# EAGLE schematic Main_Board (EAGLE 9.2.2)
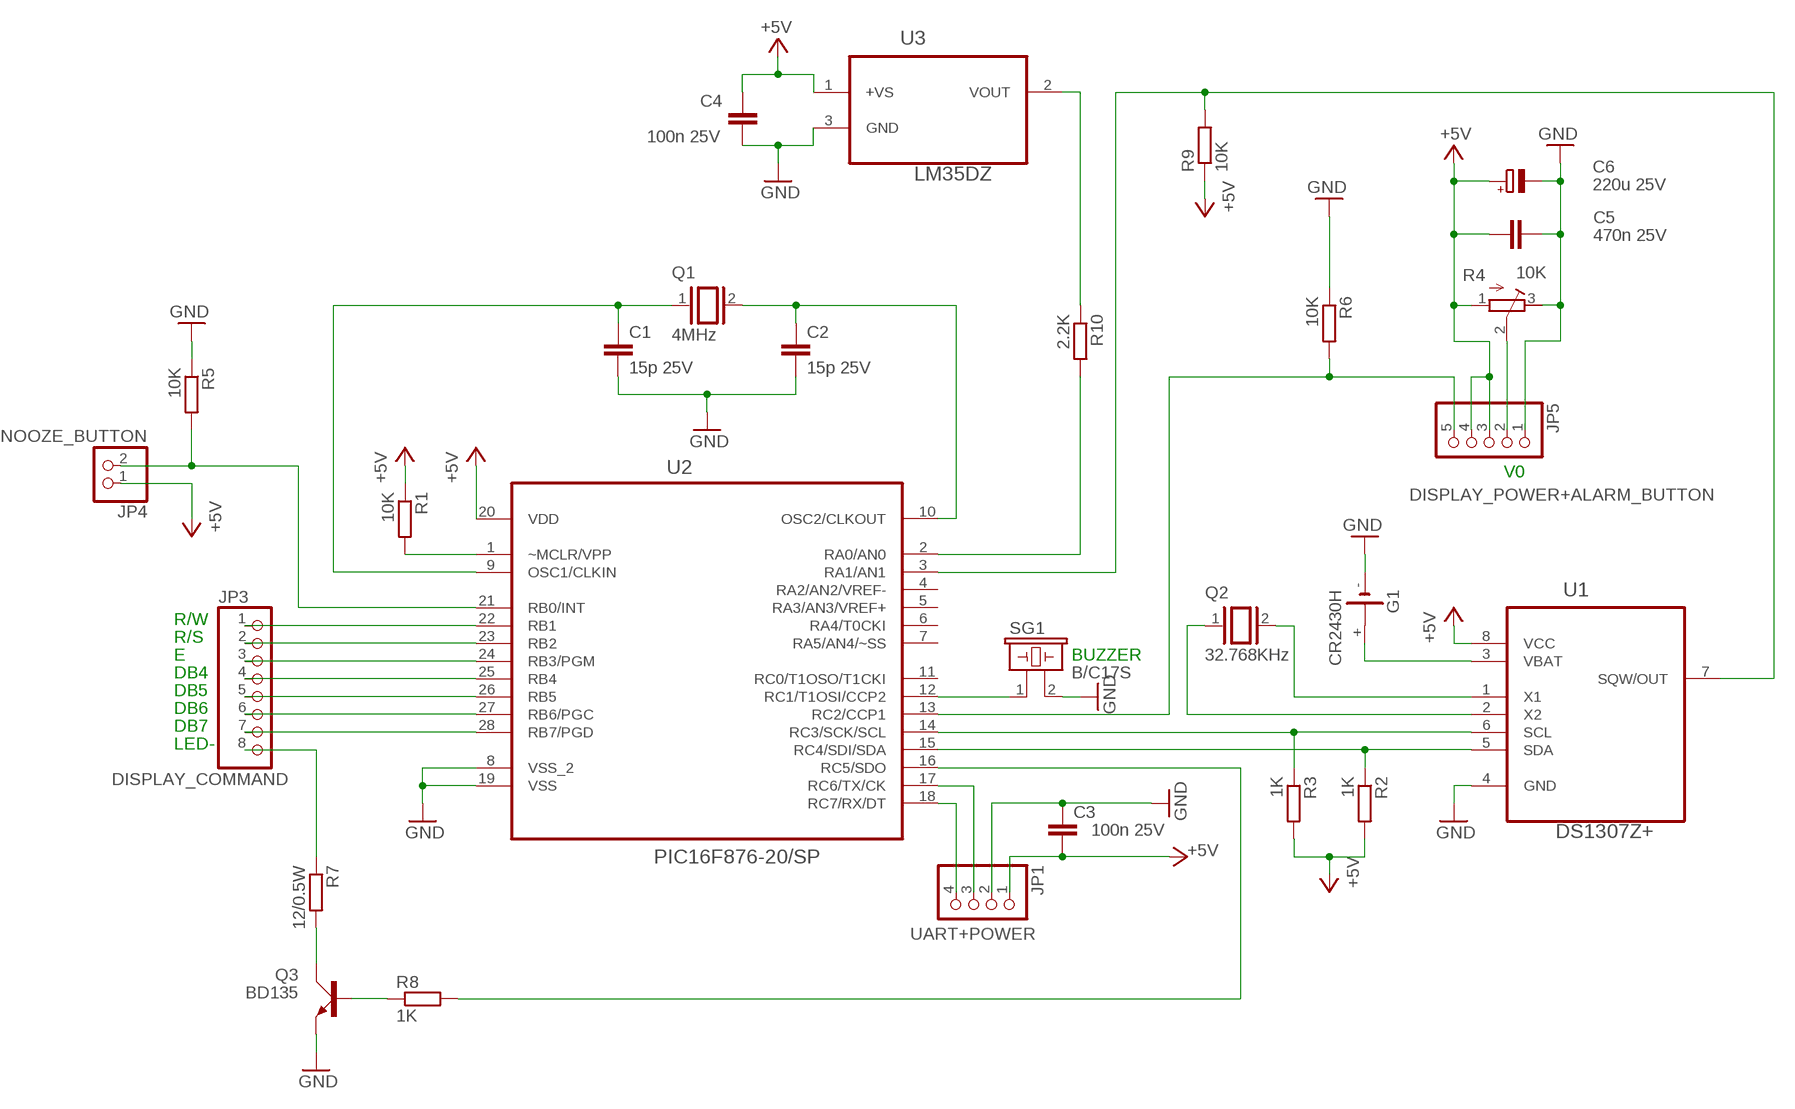
[diagram p0: schematic, sheet 1]

## Parts
C1  15p 25V  C2,5-3  [C2.5-3]
C2  15p 25V  C2,5-3  [C2.5-3]
C3  100n 25V  C5/3.5  [C5B3.5]
C4  100n 25V  C-EU025-025X050  [C025-025X050]
C5  470n 25V  C-EU025-025X050  [C025-025X050]
C6  220u 25V  CPOL-EUE2.5-6  [E2,5-6]
G1  CR2430H  [CR2430H]
JP1  UART+POWER  PINHD-1X4  [1X04]
JP3  DISPLAY_COMMAND  PINHD-1X8  [1X08]
JP4  SNOOZE_BUTTON  PINHD-1X2  [1X02]
JP5  DISPLAY_POWER+ALARM_BUTTON  PINHD-1X5  [1X05]
Q1  4MHz  XTAL/S  [QS]
Q2  32.768KHz  XTAL/S  [QS]
Q3  BD135  BD139  [TO126AV]
R1  10K  R-EU_0207/12  [0207/12]
R2  1K  R-EU_0207/12  [0207/12]
R3  1K  R-EU_0207/12  [0207/12]
R4  10K  R-TRIMM3339P  [RTRIM3339P]
R5  10K  R-EU_0207/12  [0207/12]
R6  10K  R-EU_0207/12  [0207/12]
R7  12/0.5W  R-EU_0207/12  [0207/12]
R8  1K  R-EU_0207/12  [0207/12]
R9  10K  R-EU_0207/12  [0207/12]
R10  2.2K  R-EU_0207/12  [0207/12]
SG1  B/C17S  [B/C17S]
U1  DS1307Z+  [SOIC127P600X175-8N]
U2  PIC16F876-20/SP  [DIP254P762X406-28]
U3  LM35DZ  [TO127P254X495-3P]

## Nets
+5V: C3.2 C4.1 C5.1 C6.+ JP1.1 JP4.1 JP5.3 JP5.4 R1.1 R2.2 R3.2 R4.1(A) R9.1 U1.8(VCC) U2.20(VDD) U3.1(+VS)
GND: C1.2 C2.2 C3.1 C4.2 C5.2 C6.- G1.- JP1.2 JP5.1 Q3.E R4.3(E) R5.1 R6.1 SG1.2 U1.4(GND) U2.8(VSS_2) U2.19(VSS) U3.3(GND)
N$1: R1.2 U2.1(~MCLR/VPP)
N$2: C1.1 Q1.1 U2.9(OSC1/CLKIN)
N$3: C2.1 Q1.2 U2.10(OSC2/CLKOUT)
N$4: SG1.1 U2.12(RC1/T1OSI/CCP2)
N$5: Q2.2 U1.1(X1)
N$6: G1.+ U1.3(VBAT)
N$7: Q2.1 U1.2(X2)
N$8: R2.1 U1.5(SDA) U2.15(RC4/SDI/SDA)
N$9: R3.1 U1.6(SCL) U2.14(RC3/SCK/SCL)
N$10: R9.2 U1.7(SQW/OUT) U2.3(RA1/AN1)
N$11: JP3.1 U2.22(RB1)
N$12: JP3.2 U2.23(RB2)
N$13: JP3.3 U2.24(RB3/PGM)
N$14: JP3.4 U2.25(RB4)
N$15: JP3.5 U2.26(RB5)
N$16: JP3.6 U2.27(RB6/PGC)
N$17: JP3.7 U2.28(RB7/PGD)
N$18: R8.2 U2.16(RC5/SDO)
N$19: JP5.2 R4.2(S)
N$20: JP1.4 U2.18(RC7/RX/DT)
N$21: JP1.3 U2.17(RC6/TX/CK)
N$22: JP5.5 R6.2 U2.13(RC2/CCP1)
N$23: JP3.8 R7.1
N$24: JP4.2 R5.2 U2.21(RB0/INT)
N$25: Q3.C R7.2
N$26: Q3.B R8.1
N$27: R10.2 U2.2(RA0/AN0)
N$28: R10.1 U3.2(VOUT)
Unconnected: G1.+@1(+) U2.4(RA2/AN2/VREF-) U2.5(RA3/AN3/VREF+) U2.6(RA4/T0CKI) U2.7(RA5/AN4/~SS) U2.11(RC0/T1OSO/T1CKI)

## Notes on the sheet
- V0
- R/W
- R/S
- E | BUZZER
- DB4
- DB5
- DB6
- DB7
- LED-

## Library data of the parts
C1-C3 = capacitor-wima:C: CAPACITOR naming: grid - package width
C4 C5 = rcl:C-EU: CAPACITOR, European symbol; SPICEPREFIX: C
C6 = rcl:CPOL-EU: POLARIZED CAPACITOR, European symbol; SPICEPREFIX: C
G1 = battery:CR2430H: LI BATTERY Varta
JP1 = pinhead:PINHD-1X4: PIN HEADER
JP3 = pinhead:PINHD-1X8: PIN HEADER
JP4 = pinhead:PINHD-1X2: PIN HEADER
JP5 = pinhead:PINHD-1X5: PIN HEADER
Q1 Q2 = special:XTAL/S: CRYSTAL
Q3 = transistor-power:BD139: NPN TRANSISTOR
R1-R3 R5-R10 = resistor:R-EU_: RESISTOR, European symbol
R4 = resistor:R-TRIMM: Trimm resistor
SG1 = buzzer:B/C17S: BUZZER Source: Buerklin; OC_FARNELL: unknown; OC_NEWARK: unknown
U1 = DS1307:DS1307Z+: 64 x 8, Serial, I2C Real-Time Clock,SOIC-8; MPN: DS1307Z+; OC_FARNELL: 9726322; OC_NEWARK: 08J6234; PACKAGE: SOIC-8; SUPPLIER: Maxim
U2 = PIC16F876:PIC16F876-20/SP: Flash Microcontrollers; MPN: PIC16F876-20/SP; OC_FARNELL: 1523959; OC_NEWARK: 12C1951; PACKAGE: DIP-28; SUPPLIER: Microchip
U3 = LM35DZ:LM35DZ: IC, TEMPERATURE SENSOR, ± 0.4°C; MPN: LM35DZ; OC_FARNELL: 9488200; OC_NEWARK: 92F288; PACKAGE: TO-92; SUPPLIER: TEXAS INSTRUMENTS